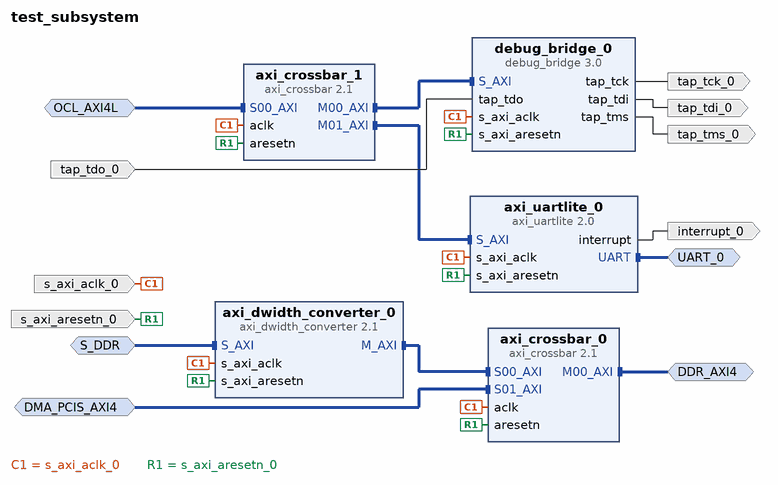
[diagram p0: block diagram of the top level]
# Vivado block design test_subsystem, xcvu9p-flga2104-1-e, Vivado 2021.1
create_bd_design test_subsystem

create_bd_intf_port -mode Slave -vlnv xilinx.com:interface:aximm_rtl:1.0 S_DDR
set_property -dict [list \
  CONFIG.ADDR_WIDTH 64 \
  CONFIG.ARUSER_WIDTH 0 \
  CONFIG.AWUSER_WIDTH 0 \
  CONFIG.BUSER_WIDTH 0 \
  CONFIG.DATA_WIDTH 64 \
  CONFIG.FREQ_HZ 10000000 \
  CONFIG.HAS_BRESP 1 \
  CONFIG.HAS_BURST 1 \
  CONFIG.HAS_CACHE 1 \
  CONFIG.HAS_LOCK 1 \
  CONFIG.HAS_PROT 1 \
  CONFIG.HAS_QOS 1 \
  CONFIG.HAS_REGION 1 \
  CONFIG.HAS_RRESP 1 \
  CONFIG.HAS_WSTRB 1 \
  CONFIG.ID_WIDTH 0 \
  CONFIG.MAX_BURST_LENGTH 256 \
  CONFIG.NUM_READ_OUTSTANDING 2 \
  CONFIG.NUM_READ_THREADS 1 \
  CONFIG.NUM_WRITE_OUTSTANDING 2 \
  CONFIG.NUM_WRITE_THREADS 1 \
  CONFIG.PROTOCOL AXI4 \
  CONFIG.READ_WRITE_MODE READ_WRITE \
  CONFIG.RUSER_BITS_PER_BYTE 0 \
  CONFIG.RUSER_WIDTH 0 \
  CONFIG.SUPPORTS_NARROW_BURST 1 \
  CONFIG.WUSER_BITS_PER_BYTE 0 \
  CONFIG.WUSER_WIDTH 0 \
] [get_bd_intf_ports S_DDR]
create_bd_intf_port -mode Master -vlnv xilinx.com:interface:aximm_rtl:1.0 DDR_AXI4
set_property -dict [list \
  CONFIG.ADDR_WIDTH 64 \
  CONFIG.DATA_WIDTH 512 \
  CONFIG.FREQ_HZ 10000000 \
  CONFIG.NUM_READ_OUTSTANDING 2 \
  CONFIG.NUM_WRITE_OUTSTANDING 2 \
  CONFIG.PROTOCOL AXI4 \
] [get_bd_intf_ports DDR_AXI4]
create_bd_intf_port -mode Slave -vlnv xilinx.com:interface:aximm_rtl:1.0 DMA_PCIS_AXI4
set_property -dict [list \
  CONFIG.ADDR_WIDTH 64 \
  CONFIG.ARUSER_WIDTH 0 \
  CONFIG.AWUSER_WIDTH 0 \
  CONFIG.BUSER_WIDTH 0 \
  CONFIG.DATA_WIDTH 512 \
  CONFIG.FREQ_HZ 10000000 \
  CONFIG.HAS_BRESP 1 \
  CONFIG.HAS_BURST 1 \
  CONFIG.HAS_CACHE 1 \
  CONFIG.HAS_LOCK 1 \
  CONFIG.HAS_PROT 1 \
  CONFIG.HAS_QOS 1 \
  CONFIG.HAS_REGION 0 \
  CONFIG.HAS_RRESP 1 \
  CONFIG.HAS_WSTRB 1 \
  CONFIG.ID_WIDTH 6 \
  CONFIG.MAX_BURST_LENGTH 256 \
  CONFIG.NUM_READ_OUTSTANDING 2 \
  CONFIG.NUM_READ_THREADS 1 \
  CONFIG.NUM_WRITE_OUTSTANDING 2 \
  CONFIG.NUM_WRITE_THREADS 1 \
  CONFIG.PROTOCOL AXI4 \
  CONFIG.READ_WRITE_MODE READ_WRITE \
  CONFIG.RUSER_BITS_PER_BYTE 0 \
  CONFIG.RUSER_WIDTH 0 \
  CONFIG.SUPPORTS_NARROW_BURST 1 \
  CONFIG.WUSER_BITS_PER_BYTE 0 \
  CONFIG.WUSER_WIDTH 0 \
] [get_bd_intf_ports DMA_PCIS_AXI4]
create_bd_intf_port -mode Slave -vlnv xilinx.com:interface:aximm_rtl:1.0 OCL_AXI4L
set_property -dict [list \
  CONFIG.ADDR_WIDTH 32 \
  CONFIG.ARUSER_WIDTH 0 \
  CONFIG.AWUSER_WIDTH 0 \
  CONFIG.BUSER_WIDTH 0 \
  CONFIG.DATA_WIDTH 32 \
  CONFIG.FREQ_HZ 10000000 \
  CONFIG.HAS_BRESP 1 \
  CONFIG.HAS_BURST 0 \
  CONFIG.HAS_CACHE 0 \
  CONFIG.HAS_LOCK 0 \
  CONFIG.HAS_PROT 1 \
  CONFIG.HAS_QOS 0 \
  CONFIG.HAS_REGION 0 \
  CONFIG.HAS_RRESP 1 \
  CONFIG.HAS_WSTRB 1 \
  CONFIG.ID_WIDTH 0 \
  CONFIG.MAX_BURST_LENGTH 1 \
  CONFIG.NUM_READ_OUTSTANDING 1 \
  CONFIG.NUM_READ_THREADS 1 \
  CONFIG.NUM_WRITE_OUTSTANDING 1 \
  CONFIG.NUM_WRITE_THREADS 1 \
  CONFIG.PROTOCOL AXI4LITE \
  CONFIG.READ_WRITE_MODE READ_WRITE \
  CONFIG.RUSER_BITS_PER_BYTE 0 \
  CONFIG.RUSER_WIDTH 0 \
  CONFIG.SUPPORTS_NARROW_BURST 0 \
  CONFIG.WUSER_BITS_PER_BYTE 0 \
  CONFIG.WUSER_WIDTH 0 \
] [get_bd_intf_ports OCL_AXI4L]
create_bd_intf_port -mode Master -vlnv xilinx.com:interface:uart_rtl:1.0 UART_0
create_bd_port -dir I -type clk s_axi_aclk_0
set_property -dict [list \
  CONFIG.ASSOCIATED_BUSIF S_DDR:DDR_AXI4:DMA_PCIS_AXI4:OCL_AXI4L \
  CONFIG.FREQ_HZ 10000000 \
] [get_bd_ports s_axi_aclk_0]
create_bd_port -dir I -type rst s_axi_aresetn_0
create_bd_port -dir O tap_tdi_0
create_bd_port -dir O tap_tms_0
create_bd_port -dir O tap_tck_0
create_bd_port -dir I tap_tdo_0
create_bd_port -dir O -type intr interrupt_0

create_bd_cell -type ip -vlnv xilinx.com:ip:axi_dwidth_converter:2.1 axi_dwidth_converter_0
set_property -dict [list \
  CONFIG.ADDR_WIDTH 64 \
  CONFIG.MAX_SPLIT_BEATS 16 \
  CONFIG.MI_DATA_WIDTH 512 \
  CONFIG.SI_DATA_WIDTH 64 \
  CONFIG.SI_ID_WIDTH 16 \
] [get_bd_cells axi_dwidth_converter_0]
create_bd_cell -type ip -vlnv xilinx.com:ip:axi_crossbar:2.1 axi_crossbar_0
set_property -dict [list \
  CONFIG.ADDR_WIDTH 64 \
  CONFIG.DATA_WIDTH 512 \
  CONFIG.ID_WIDTH 16 \
  CONFIG.M00_A00_ADDR_WIDTH 19 \
  CONFIG.M00_A00_BASE_ADDR 0x0000000000000000 \
  CONFIG.NUM_MI 1 \
  CONFIG.NUM_SI 2 \
  CONFIG.S01_BASE_ID 0x00008000 \
  CONFIG.S02_BASE_ID 0x00010000 \
  CONFIG.S03_BASE_ID 0x00018000 \
  CONFIG.S04_BASE_ID 0x00020000 \
  CONFIG.S05_BASE_ID 0x00028000 \
  CONFIG.S06_BASE_ID 0x00030000 \
  CONFIG.S07_BASE_ID 0x00038000 \
  CONFIG.S08_BASE_ID 0x00040000 \
  CONFIG.S09_BASE_ID 0x00048000 \
  CONFIG.S10_BASE_ID 0x00050000 \
  CONFIG.S11_BASE_ID 0x00058000 \
  CONFIG.S12_BASE_ID 0x00060000 \
  CONFIG.S13_BASE_ID 0x00068000 \
  CONFIG.S14_BASE_ID 0x00070000 \
  CONFIG.S15_BASE_ID 0x00078000 \
] [get_bd_cells axi_crossbar_0]
create_bd_cell -type ip -vlnv xilinx.com:ip:axi_crossbar:2.1 axi_crossbar_1
set_property -dict [list \
  CONFIG.M00_A00_BASE_ADDR 0x0000000000000000 \
  CONFIG.M01_A00_BASE_ADDR 0x0000000000080000 \
  CONFIG.PROTOCOL AXI4LITE \
  CONFIG.R_REGISTER 1 \
] [get_bd_cells axi_crossbar_1]
create_bd_cell -type ip -vlnv xilinx.com:ip:debug_bridge:3.0 debug_bridge_0
set_property -dict {CONFIG.C_DEBUG_MODE 3 CONFIG.C_DESIGN_TYPE 0} [get_bd_cells debug_bridge_0]
create_bd_cell -type ip -vlnv xilinx.com:ip:axi_uartlite:2.0 axi_uartlite_0

# ---- connections ----

connect_bd_intf_net -intf_net S00_AXI_0_1 [get_bd_intf_ports OCL_AXI4L] [get_bd_intf_pins axi_crossbar_1/S00_AXI]
connect_bd_intf_net -intf_net S01_AXI_0_1 [get_bd_intf_ports DMA_PCIS_AXI4] [get_bd_intf_pins axi_crossbar_0/S01_AXI]
connect_bd_intf_net -intf_net S_AXI_0_1 [get_bd_intf_ports S_DDR] [get_bd_intf_pins axi_dwidth_converter_0/S_AXI]
connect_bd_intf_net [get_bd_intf_ports DDR_AXI4] [get_bd_intf_pins axi_crossbar_0/M00_AXI]
connect_bd_intf_net [get_bd_intf_pins debug_bridge_0/S_AXI] [get_bd_intf_pins axi_crossbar_1/M00_AXI]
connect_bd_intf_net [get_bd_intf_pins axi_crossbar_1/M01_AXI] [get_bd_intf_pins axi_uartlite_0/S_AXI]
connect_bd_intf_net [get_bd_intf_pins axi_dwidth_converter_0/M_AXI] [get_bd_intf_pins axi_crossbar_0/S00_AXI]
connect_bd_intf_net [get_bd_intf_ports UART_0] [get_bd_intf_pins axi_uartlite_0/UART]
connect_bd_net [get_bd_pins axi_uartlite_0/interrupt] [get_bd_ports interrupt_0]
connect_bd_net [get_bd_pins debug_bridge_0/tap_tck] [get_bd_ports tap_tck_0]
connect_bd_net [get_bd_pins debug_bridge_0/tap_tdi] [get_bd_ports tap_tdi_0]
connect_bd_net [get_bd_pins debug_bridge_0/tap_tms] [get_bd_ports tap_tms_0]
connect_bd_net -net s_axi_aclk_0_1 [get_bd_ports s_axi_aclk_0] \
  [get_bd_pins axi_dwidth_converter_0/s_axi_aclk] [get_bd_pins axi_crossbar_0/aclk] [get_bd_pins debug_bridge_0/s_axi_aclk] \
  [get_bd_pins axi_crossbar_1/aclk] [get_bd_pins axi_uartlite_0/s_axi_aclk]
connect_bd_net -net s_axi_aresetn_0_1 [get_bd_ports s_axi_aresetn_0] \
  [get_bd_pins axi_dwidth_converter_0/s_axi_aresetn] [get_bd_pins axi_crossbar_0/aresetn] \
  [get_bd_pins debug_bridge_0/s_axi_aresetn] [get_bd_pins axi_crossbar_1/aresetn] [get_bd_pins axi_uartlite_0/s_axi_aresetn]
connect_bd_net -net tap_tdo_0_1 [get_bd_ports tap_tdo_0] [get_bd_pins debug_bridge_0/tap_tdo]

# ---- address map ----
assign_bd_address -offset 0x0000000000000000 -range 64K -target_address_space [get_bd_addr_spaces DMA_PCIS_AXI4] [get_bd_addr_segs DDR_AXI4/Reg]
assign_bd_address -offset 0x00000000 -range 64K -target_address_space [get_bd_addr_spaces OCL_AXI4L] [get_bd_addr_segs debug_bridge_0/S_AXI/Reg0]
assign_bd_address -offset 0x80000000 -range 64K -target_address_space [get_bd_addr_spaces OCL_AXI4L] [get_bd_addr_segs axi_uartlite_0/S_AXI/Reg]
assign_bd_address -offset 0x0000000000000000 -range 64K -target_address_space [get_bd_addr_spaces S_DDR] [get_bd_addr_segs DDR_AXI4/Reg]

validate_bd_design
save_bd_design
